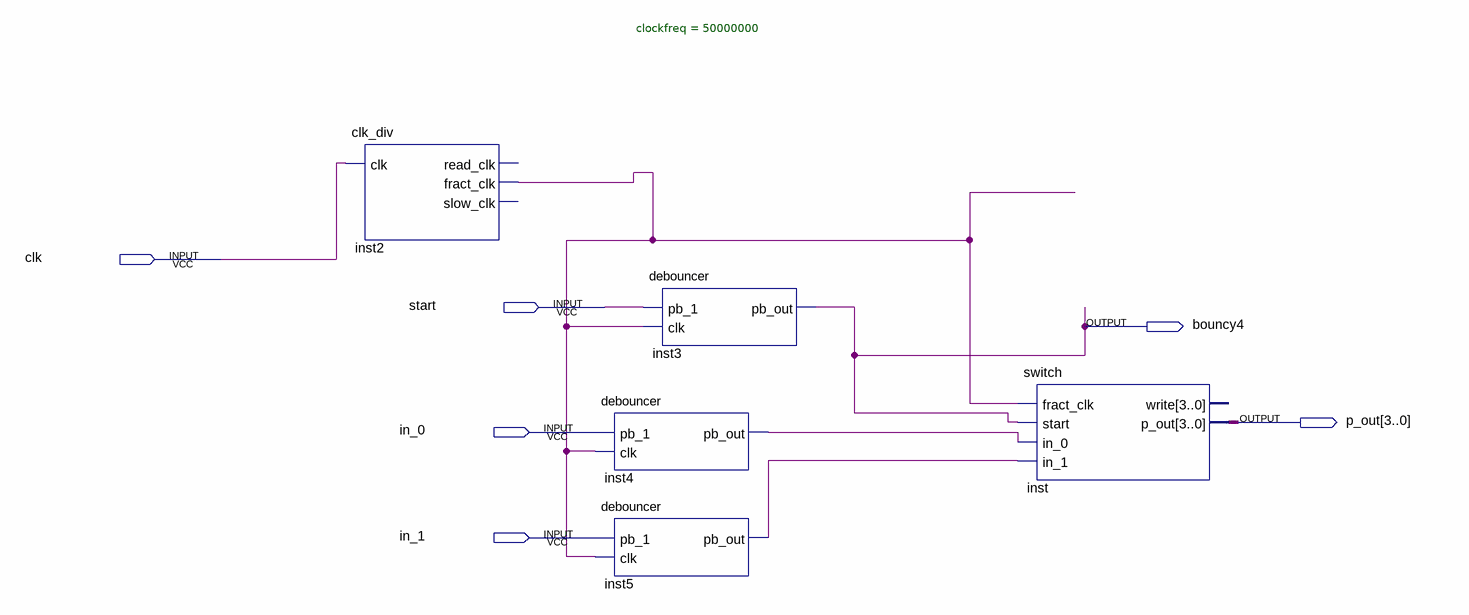
[diagram p0: schematic sheet]
// Quartus schematic button_test.bdf as structural Verilog: 5 symbols, 6 pins
module button_test (
  input  clk,
  input  start,
  input  in_0,
  input  in_1,
  output bouncy4,
  output [3:0] p_out
);

  wire inst2_fract_clk, inst4_pb_out, inst5_pb_out;

  clk_div #(.clockfreq(50000000)) inst2 (.clk(clk), .fract_clk(inst2_fract_clk));  // open: read_clk, slow_clk
  debouncer inst4 (.pb_1(in_0), .clk(inst2_fract_clk), .pb_out(inst4_pb_out));
  debouncer inst5 (.pb_1(in_1), .clk(inst2_fract_clk), .pb_out(inst5_pb_out));
  debouncer inst3 (.pb_1(start), .clk(inst2_fract_clk), .pb_out(bouncy4));
  switch inst (
    .fract_clk(inst2_fract_clk), .start(bouncy4), .in_0(inst4_pb_out), .in_1(inst5_pb_out), .p_out(p_out));  // open: write
endmodule
